# EAGLE design SeniorDesignComplete (EAGLE 7.0.0)
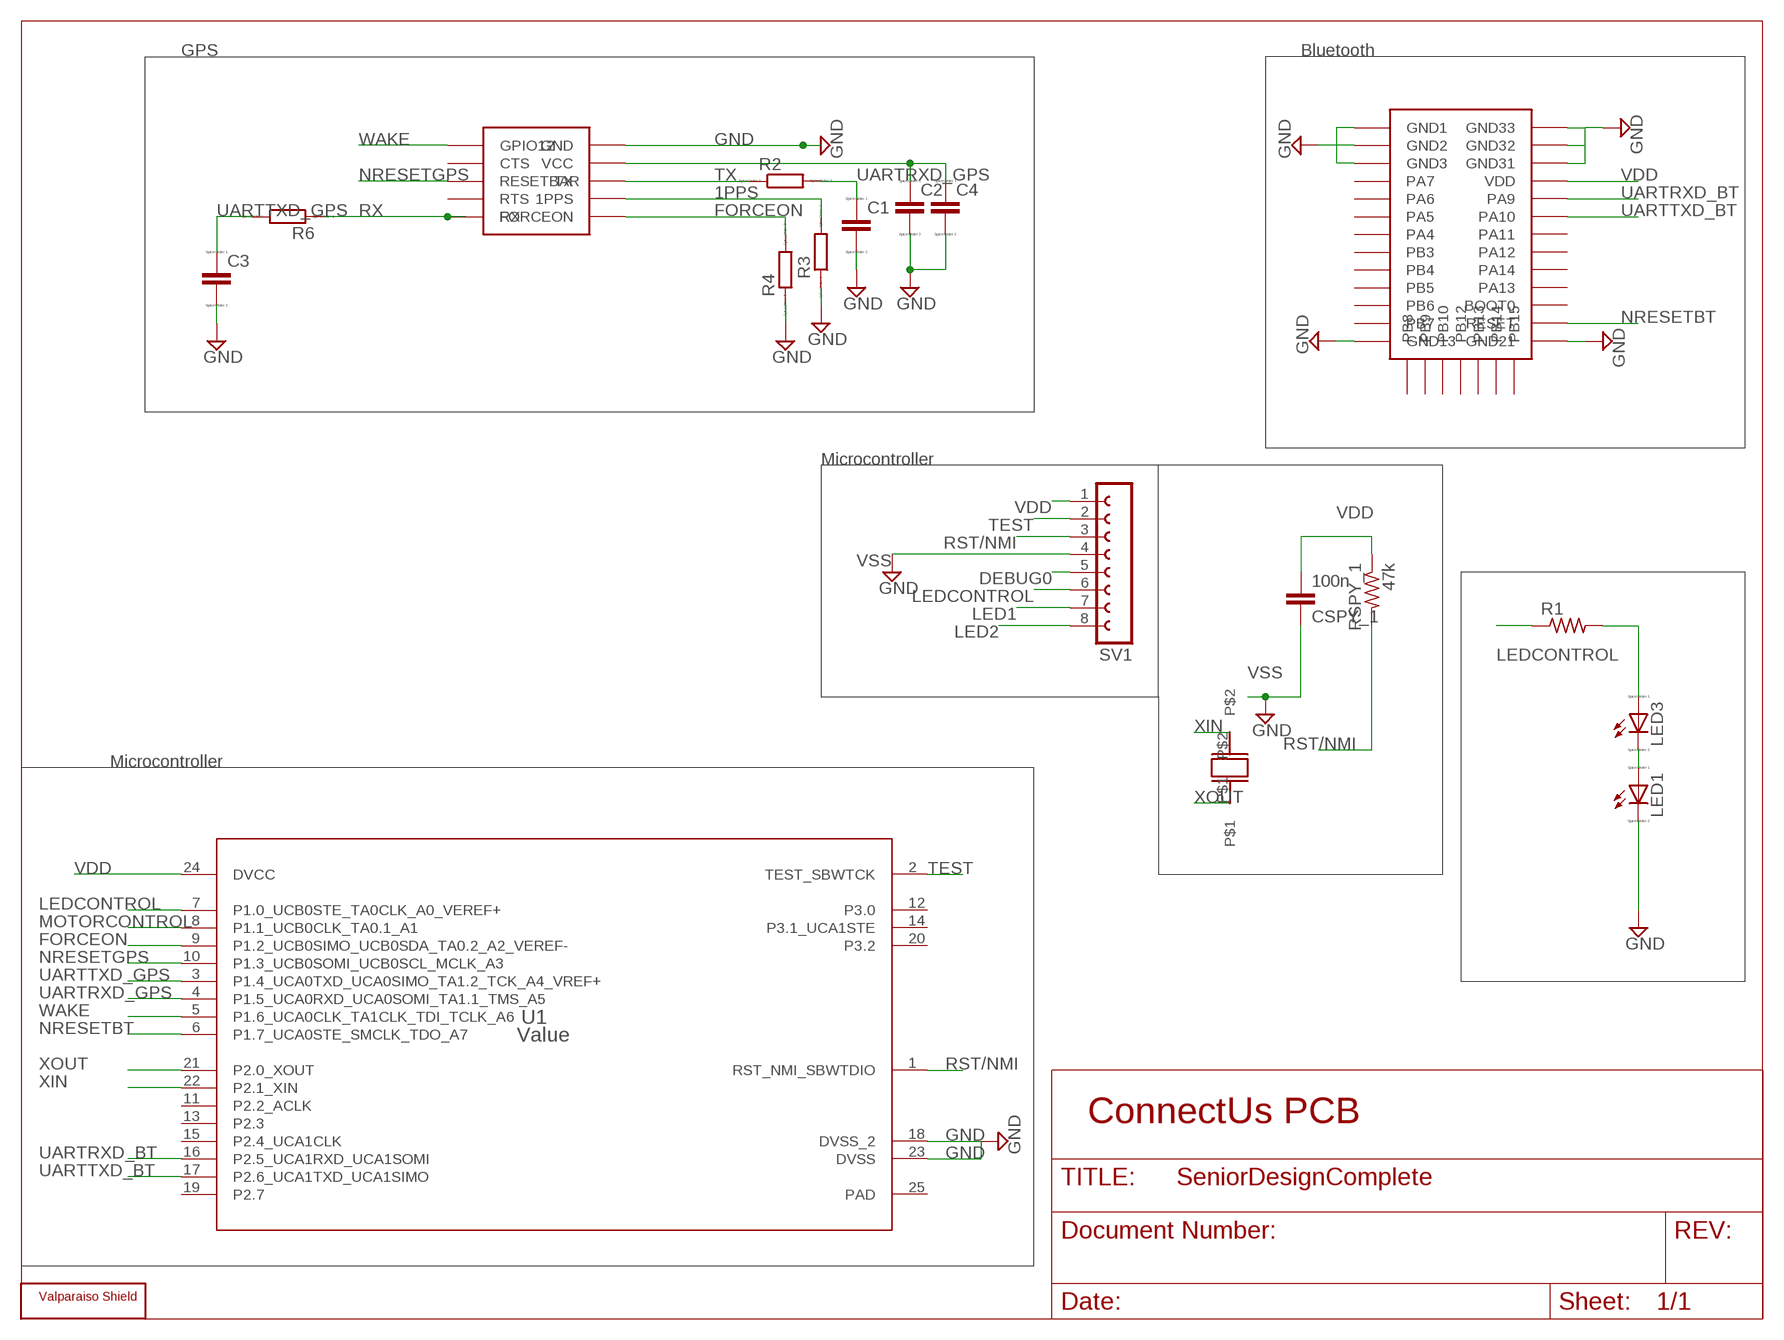
[diagram p0: schematic, sheet 1]

## Parts
C1  C  [C0805]
C2  C  [C0805]
C3  C  [C0805]
C4  C  [C0805]
CSPY_1  100n  C-EUC1206  [C1206]
GPS(ORG1510)  ORG1510  [ORG1510]
LED1  LED_ELD260  [LED_LD260]
LED3  LED_ELD260  [LED_LD260]
R1  R-US_0204/2V  [0204V]
R2  R  [R0805]
R3  R  [R0805]
R4  R  [R0805]
R6  R  [R0805]
RSPY_1  47k  R-US_R1206  [R1206]
SV1  FE08-1  [FE08]
U1  Value  MSP430FR2433IRGER  [RGE0024G]
U$2  BT121  [BT121]
U$11  VALPARAISO-SHIELD  [VUSHIELD-200MIL]
UCRY_1  ECX31-BSOLDERABLE  [ECX31-B_EXPAND]

## Nets
1PPS: GPS(ORG1510).1PPS R3.2
DEBUG0: SV1.5
FORCEON: GPS(ORG1510).FORCEON R4.2 U1.9(P1.2_UCB0SIMO_UCB0SDA_TA0.2_A2_VEREF-)
GND: C1.2 C2.2 C3.2 C4.2 GPS(ORG1510).GND LED1.K(C) R3.1 R4.1 U1.18(DVSS_2) U1.23(DVSS) U$2.GND1 U$2.GND2 U$2.GND3 U$2.GND13 U$2.GND21 U$2.GND31 U$2.GND32 U$2.GND33
LED1: SV1.7
LED2: SV1.8
LEDCONTROL: R1.1 SV1.6 U1.7(P1.0_UCB0STE_TA0CLK_A0_VEREF+)
MOTORCONTROL: U1.8(P1.1_UCB0CLK_TA0.1_A1)
N$1: LED1.A LED3.K(C)
N$3: C2.1 C4.1 GPS(ORG1510).VCC
N$14: LED3.A R1.2
NRESETBT: U1.6(P1.7_UCA0STE_SMCLK_TDO_A7) U$2.RESET
NRESETGPS: GPS(ORG1510).RESETBAR U1.10(P1.3_UCB0SOMI_UCB0SCL_MCLK_A3)
RST/NMI: RSPY_1.2 SV1.3 U1.1(RST_NMI_SBWTDIO)
RX: GPS(ORG1510).RX R6.1
TEST: SV1.2 U1.2(TEST_SBWTCK)
TX: GPS(ORG1510).TX R2.1
UARTRXD_BT: U1.16(P2.5_UCA1RXD_UCA1SOMI) U$2.PA9
UARTRXD_GPS: C1.1 R2.2 U1.4(P1.5_UCA0RXD_UCA0SOMI_TA1.1_TMS_A5)
UARTTXD_BT: U1.17(P2.6_UCA1TXD_UCA1SIMO) U$2.PA10
UARTTXD_GPS: C3.1 R6.2 U1.3(P1.4_UCA0TXD_UCA0SIMO_TA1.2_TCK_A4_VREF+)
VDD: CSPY_1.2 RSPY_1.1 SV1.1 U1.24(DVCC) U$2.VDD
VSS: CSPY_1.1 SV1.4 ; supply symbol labelled GND
WAKE: GPS(ORG1510).GPIO12 U1.5(P1.6_UCA0CLK_TA1CLK_TDI_TCLK_A6)
XIN: U1.22(P2.1_XIN) UCRY_1.P$2
XOUT: U1.21(P2.0_XOUT) UCRY_1.P$1
Unconnected: GPS(ORG1510).CTS GPS(ORG1510).RTS U1.11(P2.2_ACLK) U1.12(P3.0) U1.13(P2.3) U1.14(P3.1_UCA1STE) U1.15(P2.4_UCA1CLK) U1.19(P2.7) U1.20(P3.2) U$2.BOOT0 U$2.PA4 U$2.PA5 U$2.PA6 U$2.PA7 U$2.PA11 U$2.PA12 U$2.PA13 U$2.PA14 U$2.PB3 U$2.PB4 U$2.PB5 U$2.PB6 U$2.PB7 U$2.PB8 U$2.PB9 U$2.PB10 U$2.PB12 U$2.PB13 U$2.PB14 U$2.PB15

## Notes on the sheet
- GPS | Bluetooth
- Microcontroller
- Microcontroller
- ConnectUs PCB

## Power pins joined to a net without a drawn wire
PAD: U1.25(PAD)

## Library data of the parts
C1-C4 = eagle-ltspice:C: CAPACITOR, European symbol; SPICEMODEL: NONE; SPICEPREFIX: C
CSPY_1 = rcl:C-EU: CAPACITOR, European symbol
GPS(ORG1510) = MyLib:ORG1510
LED1 LED3 = eagle-ltspice:LED_E: LED Source: http://www.osram.convergy.de Source: www.luxeon.com Source: www.kingbright.com; SPICEMODEL: NONE; SPICEPREFIX: D; SPICETYPE: diode
R1 RSPY_1 = rcl:R-US_: RESISTOR, American symbol
R2-R4 R6 = eagle-ltspice:R: RESISTOR, European symbol; SPICEMODEL: NONE; SPICEPREFIX: R
SV1 = con-lsta:FE08-1: FEMALE HEADER; OC_FARNELL: unknown; OC_NEWARK: unknown
U1 = MSP430FR2533:MSP430FR2433IRGER; ALTERNATEPARTNUMBER: MSP430FR2433IRGET; APPLICATION_BUILDNUMBER: *; COMPTYPE: IC; MANUFACTURER: Texas Instruments; MOUNTTYPE: SMT; PACKAGEREFERENCE: RGE0024G; PARTNUMBER: MSP430FR2433IRGER; PIN_COUNT: 25; REFDES: RefDes; TYPE: TYPE
U$2 = MyLib:BT121
U$11 = VUShield:VALPARAISO-SHIELD
UCRY_1 = ECX-31b:ECX31-B

## Board
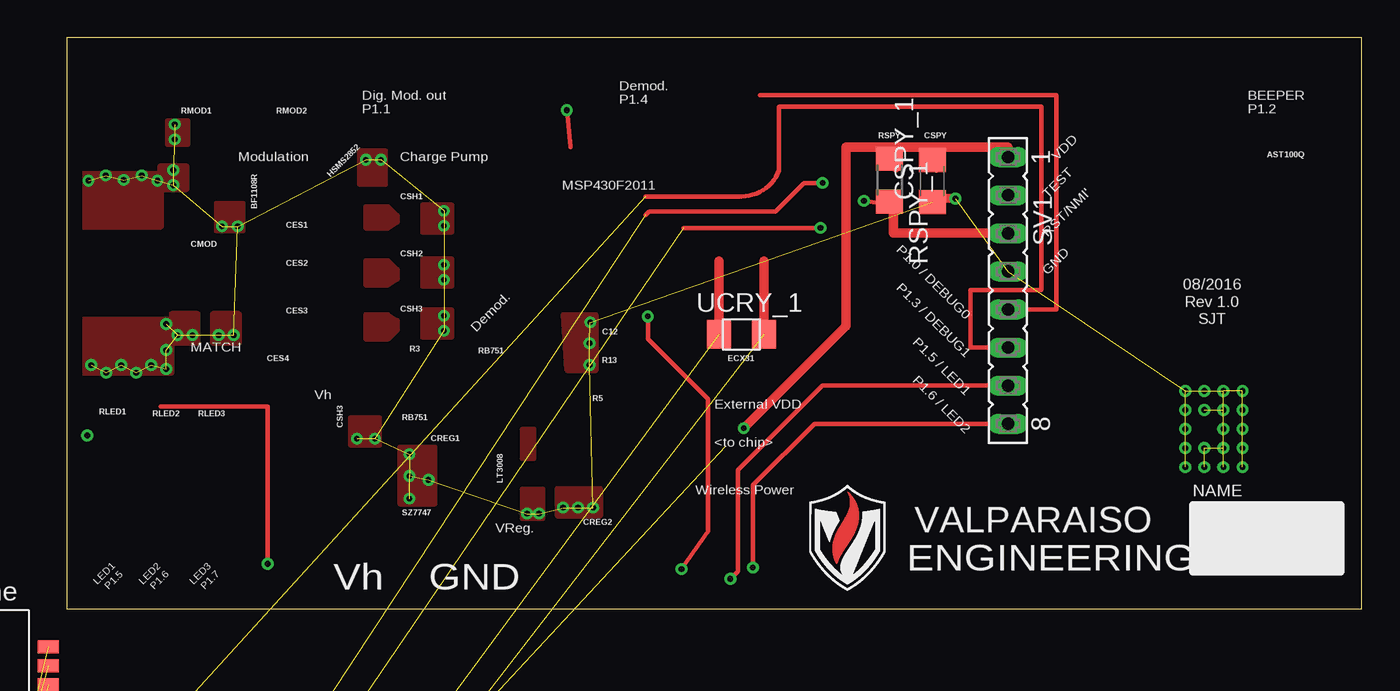
[diagram p1: board, top side]
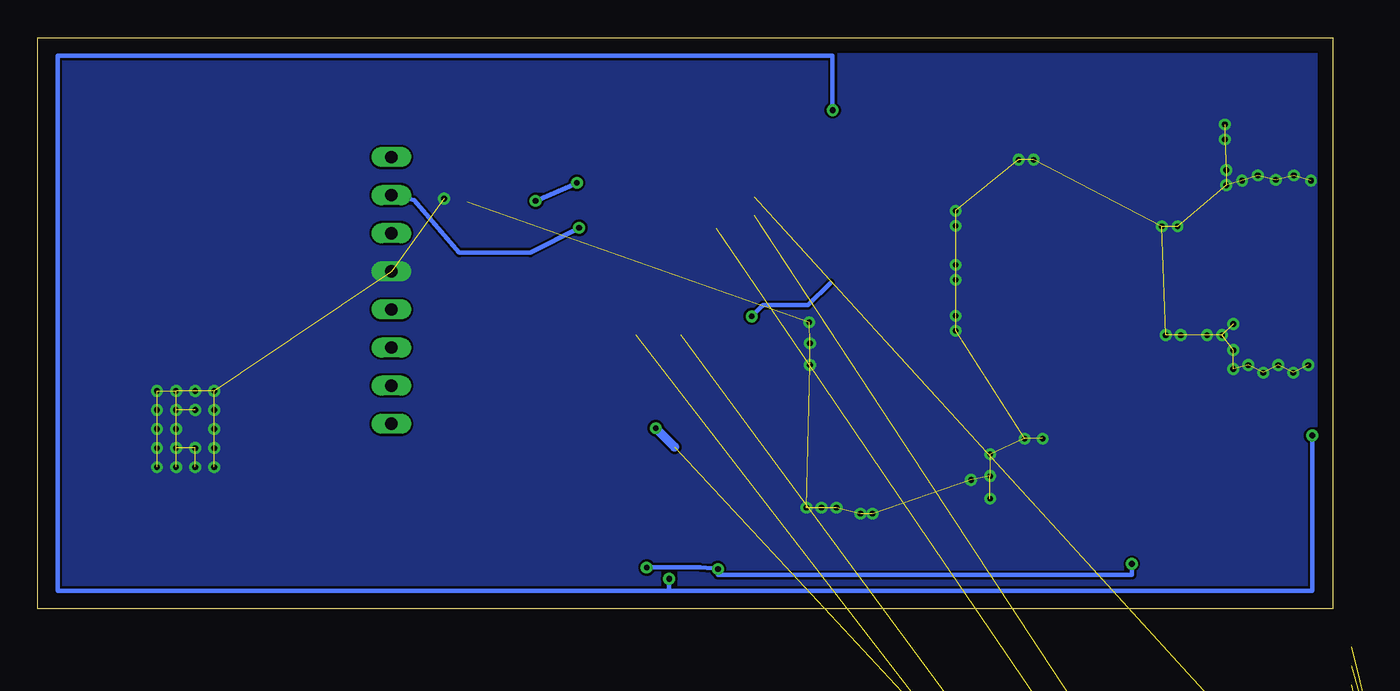
[diagram p2: board, bottom side, seen from below]

Size 86.36 x 38.1 mm. Coordinates in mm from the lower left corner, seen from the top.
Outline: 0,0 86.36,0 86.36,38.1 0,38.1 0,0
Copper layers (1*16): Top 0.035mm / dielectric 1.5mm / Bottom 0.035mm
Design rules "AdvancedCircuitsBarebones *": minimum track width 6mil, minimum drill 15mil, track to track 6mil, track to pad 6mil, pad to pad 6mil, via to via 6mil, smd to smd 0mil, copper to edge 40mil, drill to drill 6mil, minimum pad ring 10mil, minimum via ring 8mil, stop-mask expansion 4mil, vias tented up to drill 15mil, thermal gap 10mil

### Footprints (pad centres in the part's own frame; a part is rotated, then mirrored left to right if it is on the bottom)
C0805 = smd 1.3 x 1.5: 1 -0.95,0; 2 0.95,0
C1206 = smd 1.6 x 1.8: 1 -1.4,0; 2 1.4,0
ORG1510 = smd 1.422 x 0.864: 1PPS 4.485,-1.27; CTS -4.485,1.27; GND 4.485,2.54; GPIO12 -4.485,2.54; RESETBAR -4.485,0; RTS -4.485,-1.27; RX -4.485,-2.54; TX 4.485,0; VCC 4.485,1.27 | smd 1.676 x 0.864: FORCEON 4.358,-2.54
LED_LD260 = drill 0.813 octagon: A -1.27,0; K 1.27,0
0204V = drill 0.813 octagon: 1 -1.27,0; 2 1.27,0
R0805 = smd 1.3 x 1.5: 1 -0.95,0; 2 0.95,0
R1206 = smd 1.6 x 1.803: 1 -1.422,0; 2 1.422,0
FE08 = drill 0.813 long: 1 -8.89,0; 2 -6.35,0; 3 -3.81,0; 4 -1.27,0; 5 1.27,0; 6 3.81,0; 7 6.35,0; 8 8.89,0
RGE0024G = smd 0.36 x 0.24: 1 -1.9,1.25; 2 -1.9,0.75; 3 -1.9,0.25; 4 -1.9,-0.25; 5 -1.9,-0.75; 6 -1.9,-1.25; 13 1.9,-1.25; 14 1.9,-0.75; 15 1.9,-0.25; 16 1.9,0.25; 17 1.9,0.75; 18 1.9,1.25 | smd 0.24 x 0.36: 7 -1.25,-1.9; 8 -0.75,-1.9; 9 -0.25,-1.9; 10 0.25,-1.9; 11 0.75,-1.9; 12 1.25,-1.9; 19 1.25,1.9; 20 0.75,1.9; 21 0.25,1.9; 22 -0.25,1.9; 23 -0.75,1.9; 24 -1.25,1.9 | smd 2.1 x 2.1: 25 0,0 | smd 0.5 x 0.5: V 0,-0.8
BT121 = smd 2 x 0.7: BOOT0 5.1,2.95; GND1 -5.1,12.95; GND2 -5.1,11.95; GND3 -5.1,10.95; GND13 -5.1,0.95; GND21 5.1,0.95; GND31 5.1,10.95; GND32 5.1,11.95; GND33 5.1,12.95; PA4 -5.1,6.95; PA5 -5.1,7.95; PA6 -5.1,8.95; PA7 -5.1,9.95; PA9 5.1,8.95; PA10 5.1,7.95; PA11 5.1,6.95; PA12 5.1,5.95; PA13 5.1,3.95; PA14 5.1,4.95; PB3 -5.1,5.95; PB4 -5.1,4.95; PB5 -5.1,3.95; PB6 -5.1,2.95; PB7 -5.1,1.95; RESET 5.1,1.95; VDD 5.1,9.95 | smd 0.7 x 2: PB8 -3,0.4; PB9 -2,0.4; PB10 -1,0.4; PB12 0,0.4; PB13 1,0.4; PB14 2,0.4; PB15 3,0.4
ECX31-B_EXPAND = smd 1.6 x 1.9: P$1 -1.5,0; P$2 1.5,0

### Placement (x,y rotation side)
C1  -8.89,-29.84 0 top  (outside the outline)
C2  -8.89,-34.29 0 top  (outside the outline)
C3  -8.89,-38.73 0 top  (outside the outline)
C4  -8.89,-69.85 0 top  (outside the outline)
CSPY_1  57.72,28.52 90 top
GPS(ORG1510)  -5.71,-5.08 0 top
LED1  -8.26,-56.52 0 top  (outside the outline)
LED3  -8.26,-65.41 0 top  (outside the outline)
R1  -8.26,-25.4 0 top  (outside the outline)
R2  -8.89,-43.18 0 top  (outside the outline)
R3  -8.89,-74.3 0 top  (outside the outline)
R4  -8.89,-47.62 0 top  (outside the outline)
R6  -8.89,-52.07 0 top  (outside the outline)
RSPY_1  54.86,28.58 270 top
SV1  62.77,21.23 270 top
U1  -33.02,-87 0 top  (outside the outline)
U$2  -29.21,-72.39 0 top  (outside the outline)
U$11  52.07,4.45 0 top
UCRY_1  44.98,18.31 0 top

### Tracks (layer width: path | path; a pad name or v marks a point on that pad's centre or on a via)
1PPS  (1 unrouted)
DEBUG0
  Top 0.305: 46.21,34.25 66,34.25 66,19.96 SV1.5
FORCEON  (2 unrouted)
GND  (17 unrouted)
LED1  (via drill 0.38)
  Top 0.305: 1.45,11.56 v1.38,11.55 | v33.35,33.25 33.6,30.8 | SV1.7 50.38,14.88 44.75,9.25 44.75,2.5 v44.25,2
  Bottom 0.305: v1.38,11.55 1.38,1.2 44.25,1.2 | 44.25,1.2 85,1.2 85,36.87 33.35,36.87 v33.35,33.25 | v44.25,2 44.25,1.2
LED2  (via drill 0.38)
  Top 0.305: 6.28,13.5 13.4,13.5 v13.4,3 | v41,2.65 42.75,5.15 42.75,14 38.75,18 v38.75,19.5 | SV1.8 49.84,12.34 45.75,8.25 v45.75,2.75
  Bottom 0.305: v38.75,19.5 38,20.25 35,20.25 33.51,21.74 | v45.75,2.75 42.15,2.75 v41,2.65 41,2.25 13.4,2.25 v13.4,3
LEDCONTROL  (2 unrouted)
  Top 0.305: 38.59,27.5 45,27.5 arc70 47.5,29.25 47.5,33.5 65,33.5 65,21.25 60.25,21.25 60.25,17.42 SV1.6
N$1  (1 unrouted)
N$3  (2 unrouted)
N$5
  pour Top (no thermals): 20,26.8 21.4,26.8 22,26.2 22,25.8 21.4,25.4 20,25.4
N$11
  pour Top (no thermals): 20,23.2 21.4,23.2 22,22.6 22,22 21.4,21.6 20,21.6
N$14  (1 unrouted)
N$16
  pour Top (no thermals): 20,19.6 21.4,19.6 22,19.2 22,18.6 21.4,18 20,18
NRESETBT  (1 unrouted)
NRESETGPS  (1 unrouted)
RST/NMI  (via drill 0.38)  (1 unrouted)
  Top 0.305: v53.15,27.2 55.11,26.95 | v50.4,28.4 49.15,28.4 47.25,26.5 38.84,26.5 38.59,26.25
  Top 0.635: SV1.3 55.11,25.04 55.11,26.95 RSPY_1.2
  Bottom 0.305: v50.4,28.4 v53.15,27.2
RX  (1 unrouted)
TEST  (via drill 0.38)  (1 unrouted)
  Top 0.305: 41.13,25.4 v50.25,25.4
  Bottom 0.305: v50.25,25.4 53.5,23.75 58.25,23.75 61.25,27.25 SV1.2
TX  (1 unrouted)
UARTRXD_BT  (1 unrouted)
UARTRXD_GPS  (2 unrouted)
UARTTXD_BT  (1 unrouted)
UARTTXD_GPS  (2 unrouted)
VDD  (via drill 0.38)  (2 unrouted)
  Top 0.635: 55.3,30.79 51.96,30.79 51.96,18.86 v45.14,12.04 | 55.3,30.79 58,30.79 | 58,30.79 62.77,30.79 SV1.1 | RSPY_1.1 55.3,29.43 55.3,30.79 | CSPY_1.2 58,29.37 58,30.79
  Bottom 0.635: 43.89,10.79 v45.14,12.04
VDDREG
  pour Top (no thermals): 30.35,10 30.35,12 31.15,12 31.15,10
VSS  (via drill 0.38)  (65 unrouted)
  Top 0.635: CSPY_1.1 58.26,27.38 v59.26,27.35
  other vias: 74.58,14.53 75.85,14.53 77.12,14.53 78.39,14.53 74.58,13.26 75.85,13.26 77.12,13.26 78.39,13.26 74.58,11.99 77.12,11.99 78.39,11.99 74.58,10.72 75.85,10.72 77.12,10.72 78.39,10.72 74.58,9.45 75.85,9.45 77.12,9.45 78.39,9.45 1.64,16.25 2.64,15.75 3.64,16.25 4.64,15.75 5.64,16.25 6.64,16 6.64,17.25 7.39,18.25 8.39,18.25 10.14,18.25 11.14,18.25 6.64,19 6.06,28.55 5.01,28.9 3.81,28.6 2.61,28.9 1.46,28.55 7.11,29.25 7.11,28.25 10.36,25.5 11.41,25.5 25.15,25.54 25.15,26.54 25.15,21.94 25.15,22.94 25.15,18.54 25.15,19.54 19.95,29.94 20.95,29.94 19.35,11.34 20.55,11.34 34.86,16.25 34.86,17.7 34.91,19.1 22.85,10.31 22.85,8.85 22.85,7.34 30.7,6.34 31.5,6.34 33.1,6.74 34.1,6.74 35.1,6.74 7.21,32.3 7.21,31.3 24.12,8.6
  pour Bottom (no thermals): 0,0 86,0 85.75,37.75 0,37.75
  pour Top (no thermals): 7,17.75 8.75,17.75 8.75,19.65 7,19.65
  pour Top (no thermals): 9.75,17.75 11.5,17.75 11.5,19.65 9.75,19.65
  pour Top (no thermals): 1,15.75 7,15.75 7,19.25 1,19.25
  pour Top (no thermals): 6.3,29 1,29 1,25.5 6.3,25.5
  pour Top (no thermals): 6.25,28 8,28 8,29.5 6.25,29.5
  pour Top (no thermals): 10,25.25 11.75,25.25 11.75,27 10,27
  pour Top (no thermals): 25.65,25.15 25.65,26.9 23.75,26.9 23.75,25.15
  pour Top (no thermals): 25.65,21.55 25.65,23.3 23.75,23.3 23.75,21.55
  pour Top (no thermals): 25.65,18.15 25.65,19.9 23.75,19.9 23.75,18.15
  pour Top (no thermals): 21.25,28.35 21.25,30.5 19.55,30.5 19.55,28.35
  pour Top (no thermals): 20.85,10.95 20.85,12.7 18.95,12.7 18.95,10.95
  pour Top (no thermals): 33.4,15.9 33.15,19.6 35.25,19.6 35.25,15.9
  pour Top (no thermals): 24.5,10.76 24.5,7 22.25,7 22.25,10.76
  pour Top (no thermals): 30.35,8 31.75,8 31.75,6 30.35,6
  pour Top (no thermals): 32.75,8 35.55,8 35.55,6.2 32.75,6.2
  pour Top (no thermals): 8.1,30.95 8.1,32.55 6.7,32.55 6.7,30.95
WAKE  (1 unrouted)
XIN  (1 unrouted)
  Top 0.635: 46.48,23.18 UCRY_1.P$2
XOUT  (1 unrouted)
  Top 0.635: 43.48,23.18 UCRY_1.P$1

### Text on the board
tPlace: Demod. / P1.4 | RMOD1 | RMOD2 | Dig. Mod. out / P1.1 | BEEPER / P1.2 | RSPY | CSPY | Modulation | Charge Pump | VDD | AST100Q | HSMS2852 | MSP430F2011 | BF1108R | CSH1 | TEST | CES1 | RST/NMI' | CMOD | CES2 | CSH2 | GND | CES3 | CSH3 | P1.0 / DEBUG0 | 08/2016 / Rev 1.0 / SJT | Demod. | C12 | MATCH | CES4 | R3 | RB751 | ECX31 | P1.3 / DEBUG1 | R13 | P1.5 / LED1 | Vh | R5 | RLED1 | RLED2 | RLED3 | RB751 | External VDD | CSH3 | P1.6 / LED2 | CREG1 | <to chip> | LT3008 | Wireless Power | NAME | SZ7747 | CREG2 | VReg. | VALPARAISO | LED1 / P1.5 | LED2 / P1.6 | LED3 / P1.7 | ENGINEERING | Vh | GND
tDocu: Valparaiso Univ. / Wireless Computing